# Altium schematic sheet Memory.SchDoc: Microcontroller
size A3; DrawnBy: James Chen; Revision: 1.0; SheetNumber: 2; SheetTotal: 4
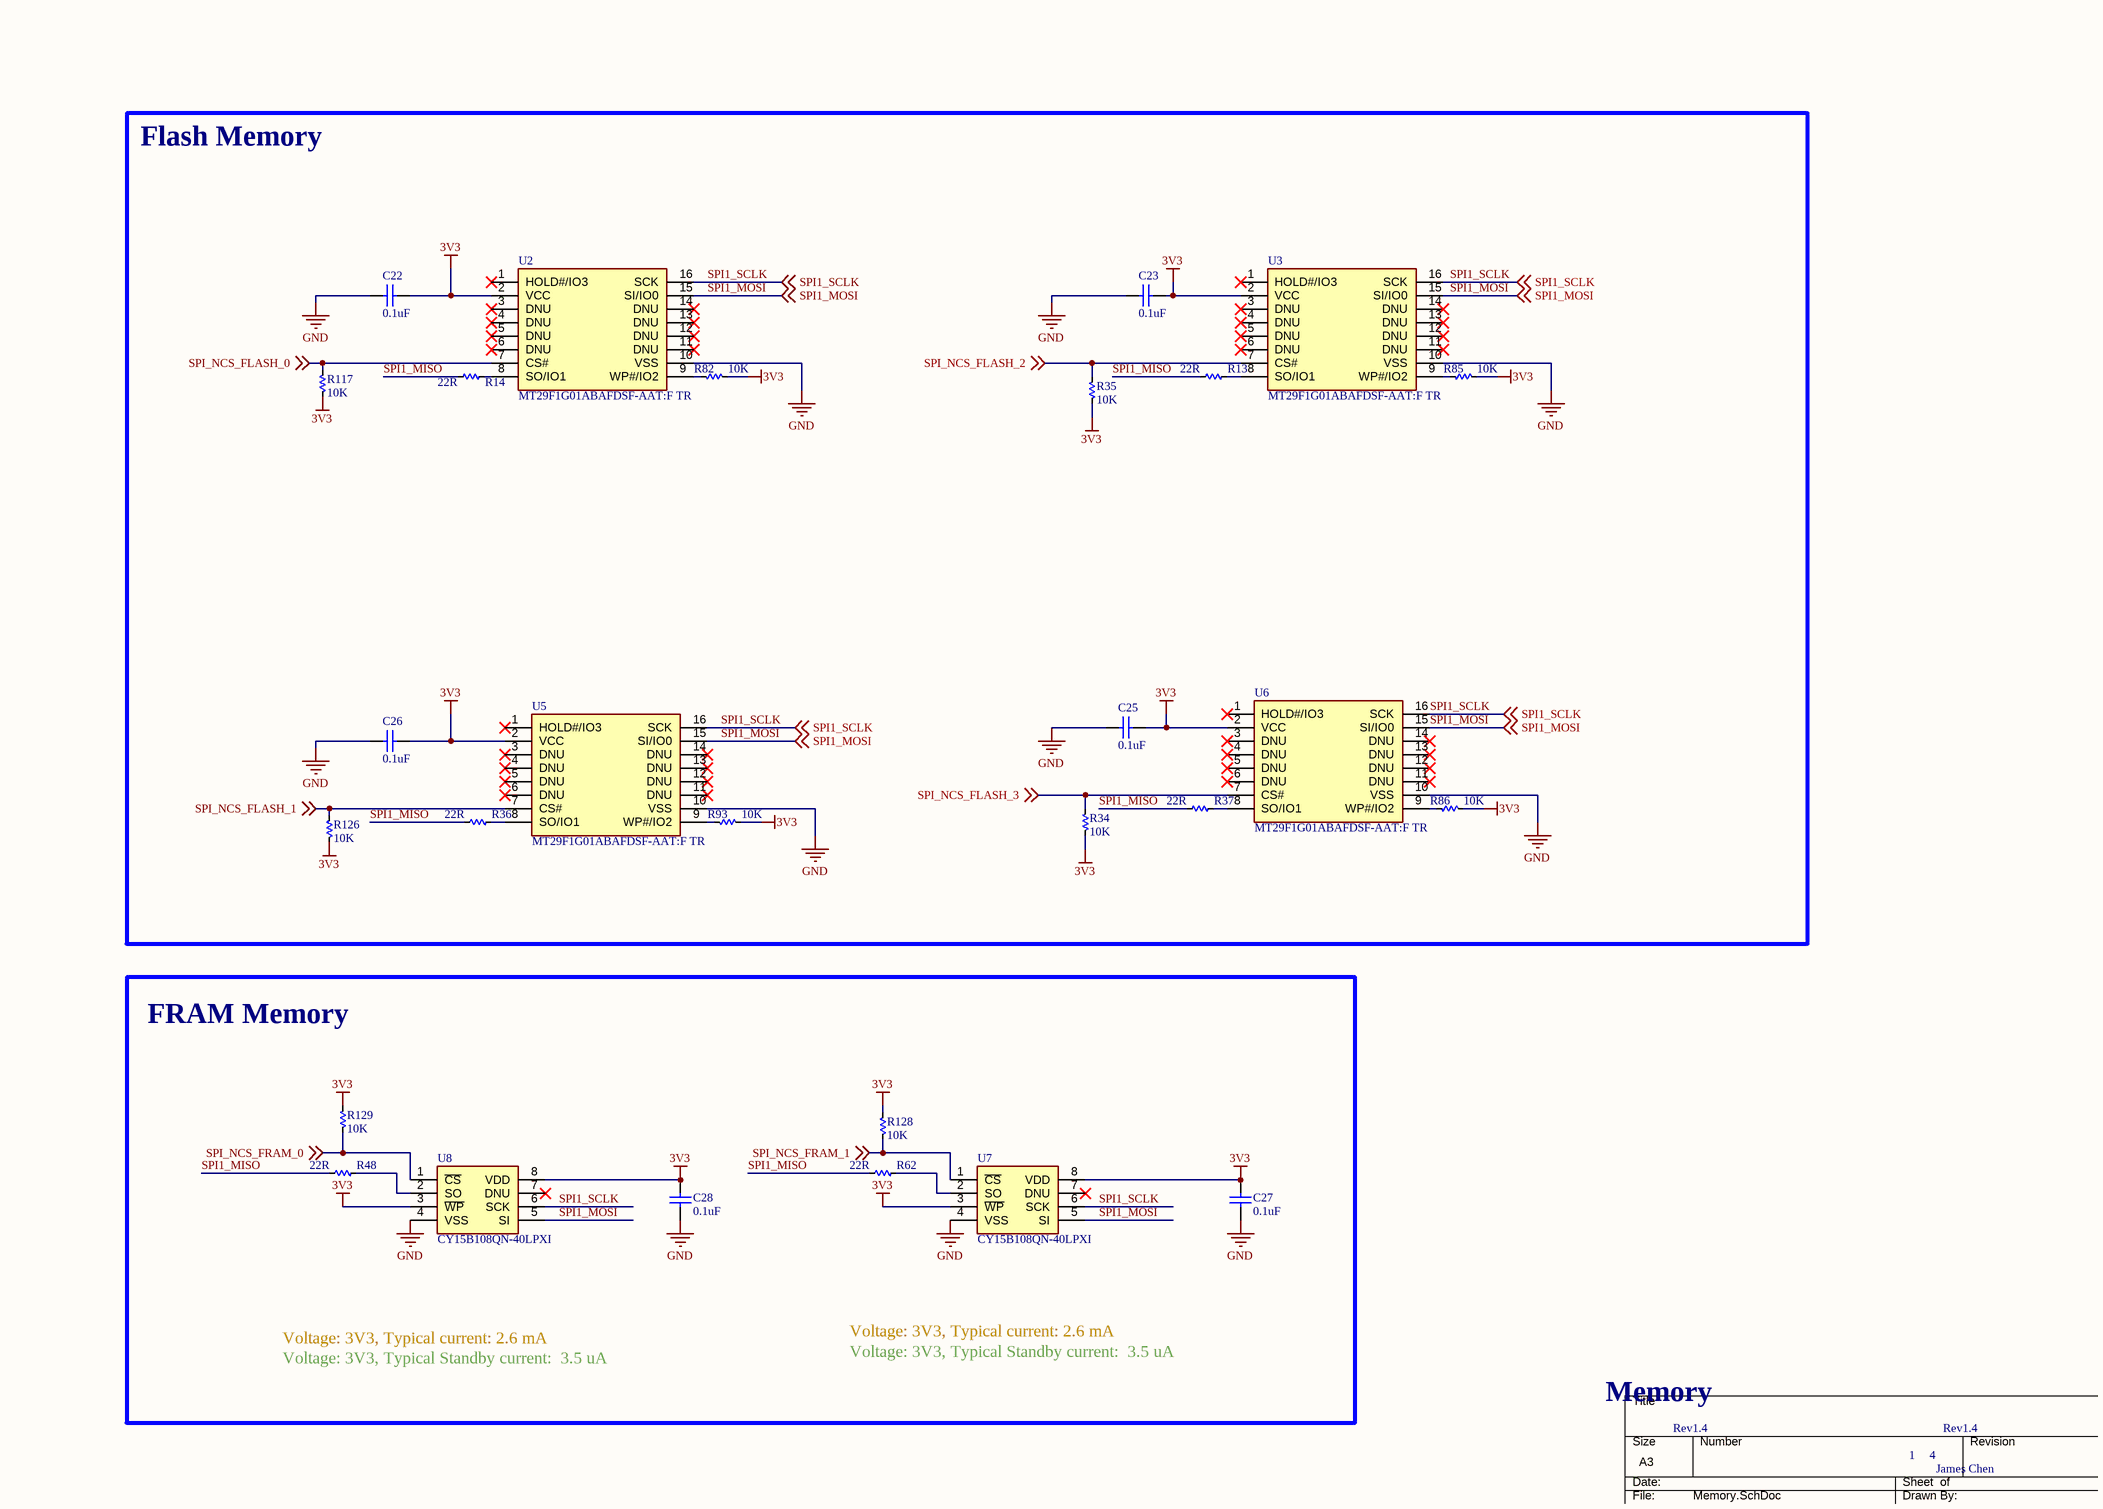
[diagram p0: Memory.SchDoc]

## Parts
C22  0.1uF  [0603]
C23  0.1uF  [0603]
C25  0.1uF  [0603]
C26  0.1uF  [0603]
C27  0.1uF  [0603]
C28  0.1uF  [0603]
R13  22R  [0603]
R14  22R  [0603]
R34  10K  [0603]
R35  10K  [0603]
R36  22R  [0603]
R37  22R  [0603]
R48  22R  [0603]
R62  22R  [0603]
R82  10K  [0603]
R85  10K  [0603]
R86  10K  [0603]
R93  10K  [0603]
R117  10K  [0603]
R126  10K  [0603]
R128  10K  [0603]
R129  10K  [0603]
U2  MT29F1G01ABAFDSF-AAT:F TR  [U-MT29F1G01ABAFDSF-AAT:F TR]
U3  MT29F1G01ABAFDSF-AAT:F TR  [U-MT29F1G01ABAFDSF-AAT:F TR]
U5  MT29F1G01ABAFDSF-AAT:F TR  [U-MT29F1G01ABAFDSF-AAT:F TR]
U6  MT29F1G01ABAFDSF-AAT:F TR  [U-MT29F1G01ABAFDSF-AAT:F TR]
U7  CY15B108QN-40LPXI  [U-CY15B108QN-40LPXI]
U8  CY15B108QN-40LPXI  [U-CY15B108QN-40LPXI]

## Blocks framed on the sheet
Flash Memory: C22 C23 C25 C26 R13 R14 R34-R37 R82 R85 R86 R93 R117 R126 U2 U3 U5 U6
FRAM Memory: C27 C28 R48 R62 R128 R129 U7 U8

## Nets
3V3: C22.1 C23.2 C25.2 C26.1 C27.1 C28.1 R34.1 R35.1 R82.1 R85.1 R86.1 R93.1 R117.1 R126.1 R128.1 R129.1 U2.2(VCC) U3.2(VCC) U5.2(VCC) U6.2(VCC) U7.3(~{WP}) U7.8(VDD) U8.3(~{WP}) U8.8(VDD)
GND: C22.2 C23.1 C25.1 C26.2 C27.2 C28.2 U2.10(VSS) U3.10(VSS) U5.10(VSS) U6.10(VSS) U7.4(VSS) U8.4(VSS)
SPI1_MISO: R13.1 R14.1 R36.1 R37.1 R48.1 R62.1
SPI1_MOSI: U2.15(SI/IO0) U3.15(SI/IO0) U5.15(SI/IO0) U6.15(SI/IO0) U7.5(SI) U8.5(SI) ; off-sheet SPI1_MOSI
SPI1_SCLK: U2.16(SCK) U3.16(SCK) U5.16(SCK) U6.16(SCK) U7.6(SCK) U8.6(SCK) ; off-sheet SPI1_SCLK
SPI_NCS_FLASH_0: R117.2 U2.7(CS#) ; off-sheet SPI_NCS_FLASH_0
SPI_NCS_FLASH_1: R126.2 U5.7(CS#) ; off-sheet SPI_NCS_FLASH_1
SPI_NCS_FLASH_2: R35.2 U3.7(CS#) ; off-sheet SPI_NCS_FLASH_2
SPI_NCS_FLASH_3: R34.2 U6.7(CS#) ; off-sheet SPI_NCS_FLASH_3
SPI_NCS_FRAM_0: R129.2 U8.1(~{CS}) ; off-sheet SPI_NCS_FRAM_0
SPI_NCS_FRAM_1: R128.2 U7.1(~{CS}) ; off-sheet SPI_NCS_FRAM_1
NetR13_2: R13.2 U3.8(SO/IO1)
NetR14_2: R14.2 U2.8(SO/IO1)
NetR36_2: R36.2 U5.8(SO/IO1)
NetR37_2: R37.2 U6.8(SO/IO1)
NetR48_2: R48.2 U8.2(SO)
NetR62_2: R62.2 U7.2(SO)
NetR82_2: R82.2 U2.9(WP#/IO2)
NetR85_2: R85.2 U3.9(WP#/IO2)
NetR86_2: R86.2 U6.9(WP#/IO2)
NetR93_2: R93.2 U5.9(WP#/IO2)

Not connected (* = marked no-connect by the designer): U2 1(HOLD#/IO3)* 3(DNU)* 4(DNU)* 5(DNU)* 6(DNU)* 11(DNU)* 12(DNU)* 13(DNU)* 14(DNU)*; U3 1(HOLD#/IO3)* 3(DNU)* 4(DNU)* 5(DNU)* 6(DNU)* 11(DNU)* 12(DNU)* 13(DNU)* 14(DNU)*; U5 1(HOLD#/IO3)* 3(DNU)* 4(DNU)* 5(DNU)* 6(DNU)* 11(DNU)* 12(DNU)* 13(DNU)* 14(DNU)*; U6 1(HOLD#/IO3)* 3(DNU)* 4(DNU)* 5(DNU)* 6(DNU)* 11(DNU)* 12(DNU)* 13(DNU)* 14(DNU)*; U7 7(DNU)*; U8 7(DNU)*

## Notes on the sheet
- Voltage: 3V3, Typical current: 2.6 mA
- Voltage: 3V3, Typical Standby current:  3.5 uA
- Memory
- Rev1.4
- 1
- 4
- James Chen
- DWG NO:
- REV:
- THIS DOCUMENT AND THE DATA DISCLOSED HEREIN OR
- HEREWITH IS THE PROPERTY OF ALTIUM LIMITED AND MAY
- BE FREELY DISTRIBUTED IN WHOLE. NO RIGHTS ARE
- RESERVED OR EXPRESS OR IMPLIED WARANTEE GIVEN.
- REVISION
- DESCRIPTION
- DATE
- APPROVED
- ENG:
- APPROVALS
- PROJECT
- DSN:
- CHK:
- REFERENCE DOCUMENTS
- PROJECT REVISION:
- TITLE
- DOCUMENT REVISION:
- DESIGN ITEM:
- BOM:
- FAB DWG:
- PCB DWG:
- ASSY DWG:
- SCALE:
- A2
- SIZE
- CAGE CODE
- FILE NAME
- DWG NO.
- SHEET
- OF
- REV

## Library data of the parts
C22 C26-C28 = CC-100nF-25V-X7R-0603: 25V 100nF X7R ±10% 0603 Multilayer Ceramic Capacitors MLCC - SMD/SMT ROHS; Manufacturer: Murata Electronics; Manufacturer Part #: GCJ188R71E104KA12D; Max Exposed Voltage: 6; Rated Voltage: 25; ComponentLink1description: Datasheet; ComponentLink1URL: https://ds.yuden.co.jp/TYCOMPAS/ut/detail?pn=TMK105BJ104KV-F%20%20&u=M; ComponentLink2description: Manufacturer Website; Distributor: LCSC; Distributor Part #: C354391; Part Description: 25V 100nF X7R ±10% 0603 Multilayer Ceramic Capacitors MLCC - SMD/SMT ROHS; ComponentLink2URL: https://www.yuden.co.jp/or/; Value: 0.1uF; Highest Rated Operating Temperature: 125; Lowest Rated Operating Temperature: -55
C23 C25 = CC-100nF-25V-X7R-0603: 25V 100nF X7R ±10% 0603 Multilayer Ceramic Capacitors MLCC - SMD/SMT ROHS; Manufacturer: Murata Electronics; Manufacturer Part #: GCJ188R71E104KA12D; Rated Voltage: 25; Max Exposed Voltage: 6; ComponentLink1description: Datasheet; ComponentLink1URL: https://ds.yuden.co.jp/TYCOMPAS/ut/detail?pn=TMK105BJ104KV-F%20%20&u=M; ComponentLink2description: Manufacturer Website; Distributor: LCSC; Distributor Part #: C354391; Part Description: 25V 100nF X7R ±10% 0603 Multilayer Ceramic Capacitors MLCC - SMD/SMT ROHS; ComponentLink2URL: https://www.yuden.co.jp/or/; Lowest Rated Operating Temperature: -55; Highest Rated Operating Temperature: 125; Value: 0.1uF
R13 R14 R36 R37 R48 R62 = RT-22R0-F-1/16W-0603: 22 Ohms ±0.5% 0.063W, 1/16W Chip Resistor 0603 (1608 Metric) - Thin Film; Manufacturer: Susumu; Manufacturer Part #: RR0816Q-220-D; ComponentLink1description: Datasheet; ComponentLink1URL: https://www.vishay.com/docs/20035/dcrcwe3.pdf; ComponentLink2description: Manufacturer Website; Distributor: Digikey; Distributor Part #: RR08Q22DCT-ND; Part Description: 22 Ohms ±0.5% 0.063W, 1/16W Chip Resistor 0603 (1608 Metric) - Thin Film; ComponentLink2URL: https://www.vishay.com/; Value: 22R
R34 R35 R82 R85 R86 R93 R117 R126 R128 R129 = RT-10K0-F-1/16W-0603: 10 kOhms ±0.1% 0.063W, 1/16W Chip Resistor 0603 (1608 Metric) - Thin Film; Manufacturer: TE Connectivity Passive Product; Manufacturer Part #: CPF0603B10KE; ComponentLink1description: Datasheet; ComponentLink1URL: https://www.vishay.com/docs/20035/dcrcwe3.pdf; ComponentLink2description: Manufacturer Website; Distributor: Digikey; Distributor Part #: A119886CT-ND; Part Description: 10 kOhms ±0.1% 0.063W, 1/16W Chip Resistor 0603 (1608 Metric) - Thin Film; ComponentLink2URL: https://www.vishay.com/; Value: 10K
U2 U3 U5 U6 = U-MT29F1G01ABAFDSF-AAT:F TR: IC FLASH 1GBIT SPI 16SO; Manufacturer: Micron Technology Inc.; Manufacturer Part #: MT29F1G01ABAFDSF-AAT:F TR; Distributer Part #: 557-1653-1-ND; Distributer: Digikey; ComponentLink1Description: Part Link; ComponentLink1URL: https://www.digikey.ca/en/products/detail/micron-technology-inc/MT29F1G01ABAFDSF-AAT-F-TR/6135560; ComponentLink2Description: Datasheet; ComponentLink2URL: https://www.farnell.com/datasheets/3151163.pdf
U7 U8 = U-CY15B108QN-40LPXI: IC FRAM 8MBIT SPI 40MHZ 8GQFN; Manufacturer: Cypress Semiconductor; Manufacturer Part #: CY15B108QN-40LPXI; Distributor: Digikey; Distributor Part #: 428-4723-ND